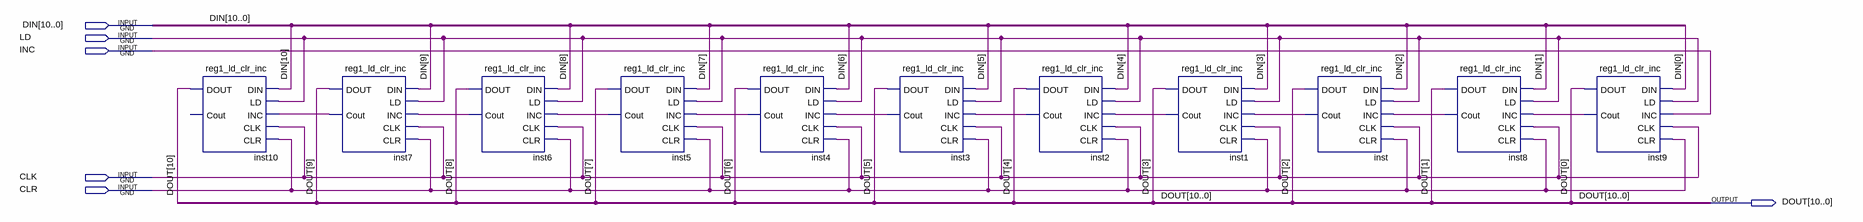
[diagram p0: schematic sheet]
// Quartus schematic reg11_ld_clr_inc.bdf as structural Verilog: 11 symbols, 6 pins
module reg11_ld_clr_inc (
  input  [10:0] DIN,
  input  LD,
  input  INC,
  input  CLK,
  input  CLR,
  output [10:0] DOUT
);

  wire inst1_cout, inst2_cout, inst3_cout, inst4_cout, inst5_cout, inst6_cout, inst7_cout, inst8_cout,
       inst9_cout, inst_cout;

  reg1_ld_clr_inc inst10 (
    .DIN(DIN[10]), .LD(LD), .INC(inst7_cout), .CLK(CLK), .CLR(CLR), .DOUT(DOUT[10]));  // open: Cout
  reg1_ld_clr_inc inst7 (
    .DIN(DIN[9]), .LD(LD), .INC(inst6_cout), .CLK(CLK), .CLR(CLR), .DOUT(DOUT[9]), .Cout(inst7_cout));
  reg1_ld_clr_inc inst6 (
    .DIN(DIN[8]), .LD(LD), .INC(inst5_cout), .CLK(CLK), .CLR(CLR), .DOUT(DOUT[8]), .Cout(inst6_cout));
  reg1_ld_clr_inc inst5 (
    .DIN(DIN[7]), .LD(LD), .INC(inst4_cout), .CLK(CLK), .CLR(CLR), .DOUT(DOUT[7]), .Cout(inst5_cout));
  reg1_ld_clr_inc inst4 (
    .DIN(DIN[6]), .LD(LD), .INC(inst3_cout), .CLK(CLK), .CLR(CLR), .DOUT(DOUT[6]), .Cout(inst4_cout));
  reg1_ld_clr_inc inst3 (
    .DIN(DIN[5]), .LD(LD), .INC(inst2_cout), .CLK(CLK), .CLR(CLR), .DOUT(DOUT[5]), .Cout(inst3_cout));
  reg1_ld_clr_inc inst2 (
    .DIN(DIN[4]), .LD(LD), .INC(inst1_cout), .CLK(CLK), .CLR(CLR), .DOUT(DOUT[4]), .Cout(inst2_cout));
  reg1_ld_clr_inc inst1 (
    .DIN(DIN[3]), .LD(LD), .INC(inst_cout), .CLK(CLK), .CLR(CLR), .DOUT(DOUT[3]), .Cout(inst1_cout));
  reg1_ld_clr_inc inst (
    .DIN(DIN[2]), .LD(LD), .INC(inst8_cout), .CLK(CLK), .CLR(CLR), .DOUT(DOUT[2]), .Cout(inst_cout));
  reg1_ld_clr_inc inst8 (
    .DIN(DIN[1]), .LD(LD), .INC(inst9_cout), .CLK(CLK), .CLR(CLR), .DOUT(DOUT[1]), .Cout(inst8_cout));
  reg1_ld_clr_inc inst9 (.DIN(DIN[0]), .LD(LD), .INC(INC), .CLK(CLK), .CLR(CLR), .DOUT(DOUT[0]), .Cout(inst9_cout));
endmodule
